# EAGLE design BIOMatrix (EAGLE 9.6.2)
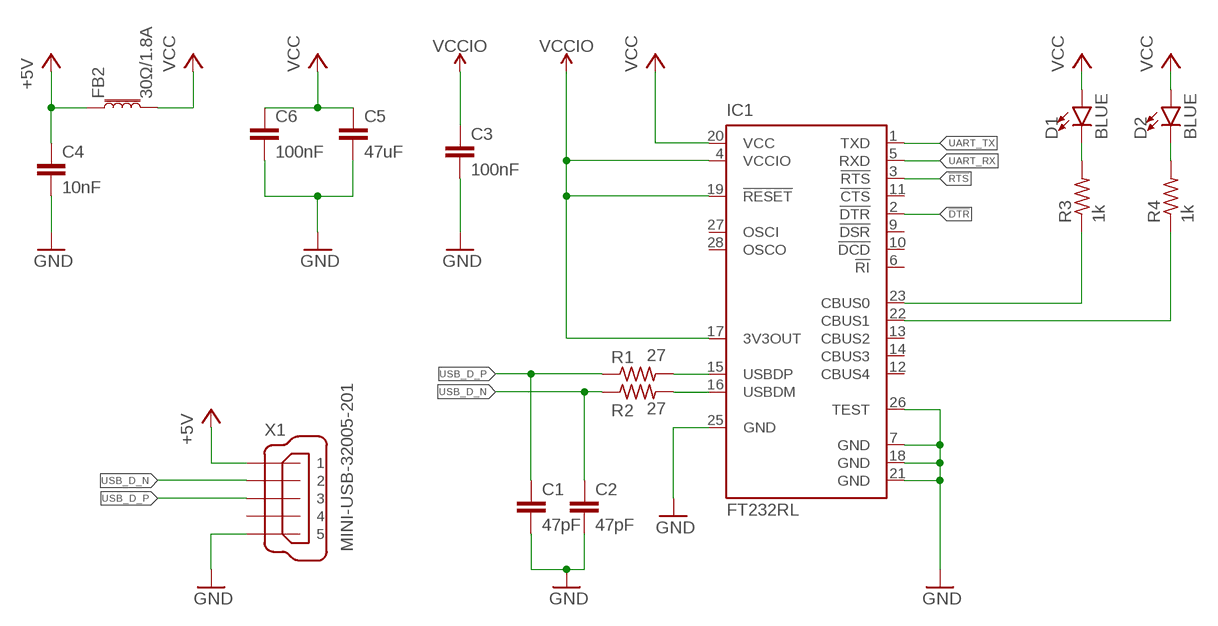
[diagram p0: schematic, sheet 1]

## Parts
C1  47pF  C-EUC0603  [C0603]
C2  47pF  C-EUC0603  [C0603]
C3  100nF  C-EUC0603  [C0603]
C4  10nF  C-EUC0603  [C0603]
C5  47uF  C-EUC0603  [C0603]
C6  100nF  C-EUC0603  [C0603]
D1  BLUE  LED-BLUE0603  [LED-0603]
D2  BLUE  LED-BLUE0603  [LED-0603]
FB2  30Ω/1.8A  FERRITE_BEAD-0603  [0603]
IC1  FT232RL  [SSOP28]
R1  27  R-US_R0603  [R0603]
R2  27  R-US_R0603  [R0603]
R3  1k  R-US_R0603  [R0603]
R4  1k  R-US_R0603  [R0603]
X1  MINI-USB-32005-201  [32005-201]

## Nets
!DTR: IC1.2(!DTR)
!RTS: IC1.3(!RTS)
+5V: C4.1 FB2.1 X1.1
GND: C1.2 C2.2 C3.2 C4.2 C5.2 C6.2 IC1.7(GND) IC1.18(GND) IC1.21(GND) IC1.25(GND) IC1.26(TEST) X1.5
N$1: IC1.15(USBDP) R1.2
N$2: D1.C R3.2
N$4: IC1.16(USBDM) R2.2
N$5: D2.C R4.2
N$6: IC1.23(CBUS0) R3.1
N$7: IC1.22(CBUS1) R4.1
UART_RX: IC1.5(RXD)
UART_TX: IC1.1(TXD)
USB_D_N [Dif_pair]: C2.1 R2.1 X1.2
USB_D_P [Dif_pair]: C1.1 R1.1 X1.3
VCC: C5.1 C6.1 D1.A D2.A FB2.2 IC1.20(VCC)
VCCIO: C3.1 IC1.4(VCCIO) IC1.17(3V3OUT) IC1.19(!RESET)
Unconnected: IC1.6(!RI) IC1.9(!DSR) IC1.10(!DCD) IC1.11(!CTS) IC1.12(CBUS4) IC1.13(CBUS2) IC1.14(CBUS3) IC1.27(OSCI) IC1.28(OSCO) X1.4

## Library data of the parts
C1-C6 = rcl:C-EU: CAPACITOR, European symbol; SPICEPREFIX: C
D1 D2 = SparkFun-LED:LED-BLUE: Blue SMD LED Used in manufacturing of various products at SparkFun Packages: 0603 - SMD 0603 package [Product Link] <http://www.digikey.com/product-detail/en/SMLE12BC7TT86/511-1589-2-ND/1641808> 1206 - SMD1206 package [Product Link] <http://www.digikey.com/product-detail/en/lite-on-inc/LTST-C150TBKT/160-1643-1-ND/573584> SparkFun Products: ESP8266 Thing-Dev Board <https://www.sparkfun.com/products/13711> RedBoard <https://www.sparkfun.com/products/12757>; PROD_ID: DIO-08575
FB2 = SparkFun-Coils:FERRITE_BEAD: Ferrite Bead (blocks, cores, rings, chokes, etc.) Inductor with layers of ferrite used to suppress high frequencies. Often used to isolate high frequency noise. SparkFun Products: IOIO-OTG - V2.2 <https://www.sparkfun.com/products/13613> SparkFun SAMD21 Mini Breakout <https://www.sparkfun.com/products/13664> SparkFun 6 Degrees of Freedom Breakout - LSM6DS3 <https://www.sparkfun.com/products/13339> SparkFun SAMD21 Dev Breakout <https://www.sparkfun.com/products/13672>; PROD_ID: NDUC-13805
IC1 = ftdichip:FT232R: Source: http://www.ftdichip.com/Documents/DataSheets/DS_FT232R_v104.pdf; MPN: FT232RL; OC_FARNELL: 1146032; OC_NEWARK: 91K9918
R1-R4 = rcl:R-US_: RESISTOR, American symbol; SPICEPREFIX: R
X1 = con-cypressindustries:MINI-USB-: MINI USB-B Conector Source: www.cypressindustries.com; OC_FARNELL: unknown; OC_NEWARK: unknown

## Net classes
1 Dif_pair: width 0.152 mm

## Board
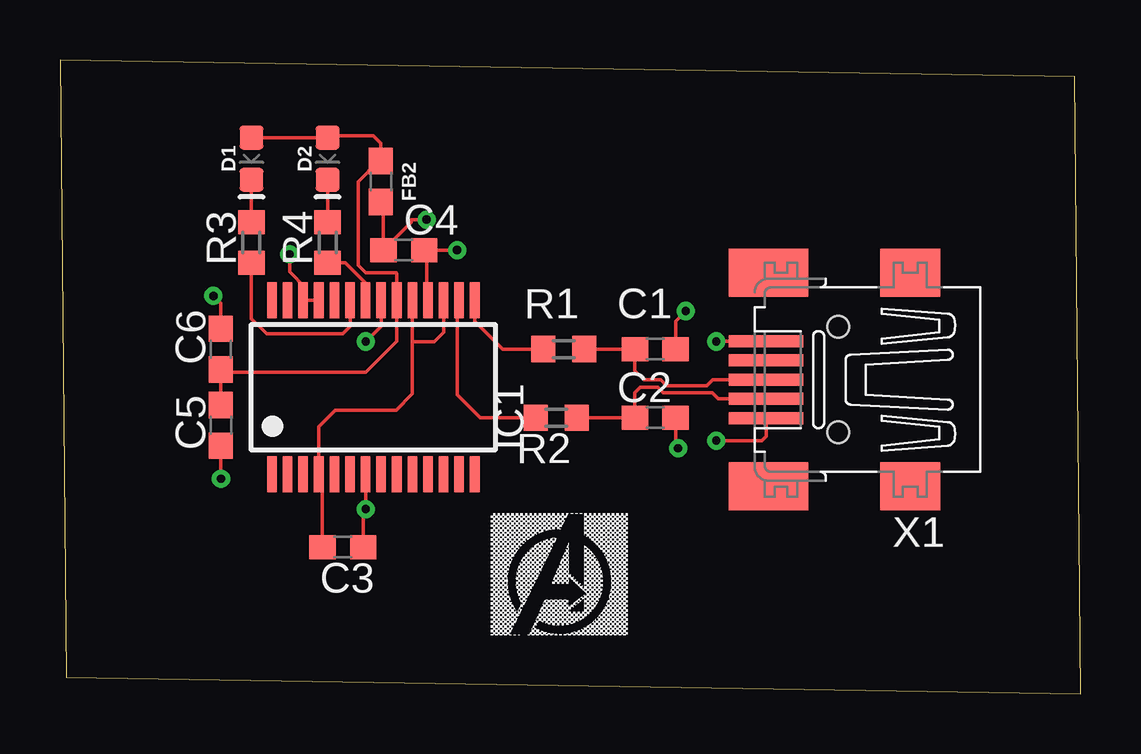
[diagram p1: board, top side]
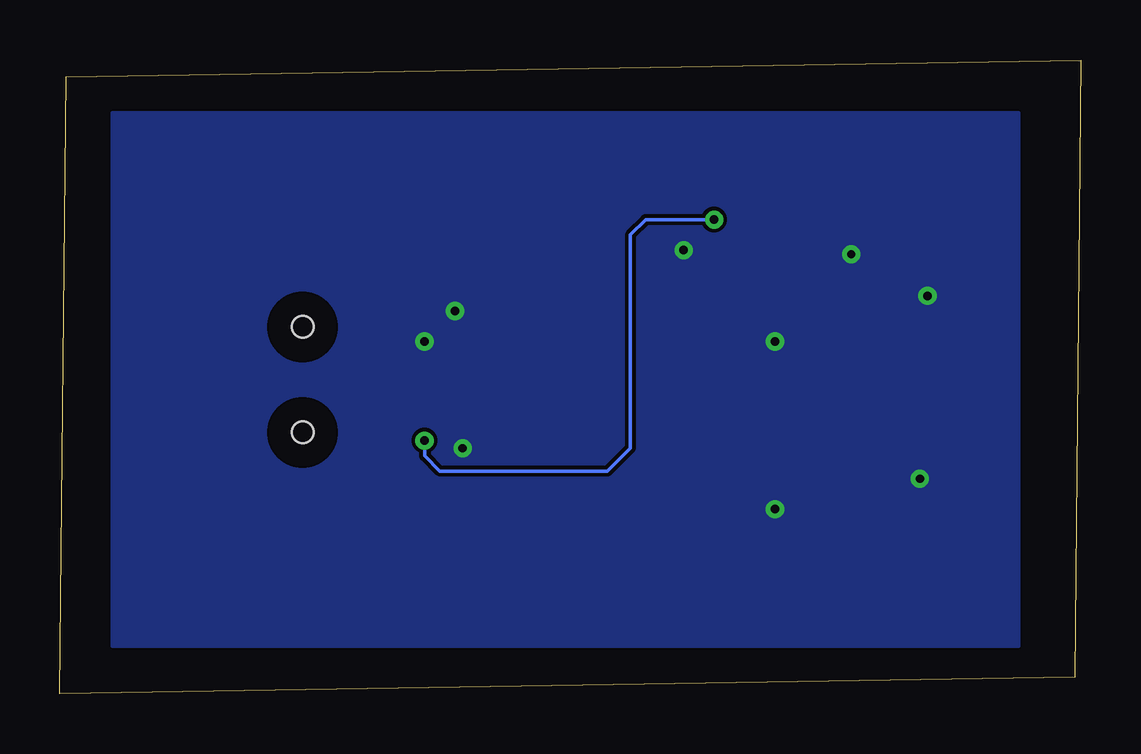
[diagram p2: board, bottom side, seen from below]

Size 42.53 x 26.41 mm. Coordinates in mm from the lower left corner, seen from the top.
Outline: 0.25,0.69 42.53,0 42.28,25.71 0,26.41 0.25,0.69
Copper layers (1*16): Top 0.035mm / dielectric 1.5mm / Bottom 0.035mm
Design rules "default": minimum track width 6mil, minimum drill 0.35mm, track to track 6mil, track to pad 6mil, pad to pad 6mil, via to via 6mil, smd to smd 6mil, copper to edge 40mil, drill to drill 6mil, minimum pad ring 10mil, minimum via ring 8mil, stop-mask expansion 4mil, vias tented up to drill 0mil, thermal gap 10mil

### Footprints (pad centres in the part's own frame; a part is rotated, then mirrored left to right if it is on the bottom)
C0603 = smd 1.1 x 1: 1 -0.85,0; 2 0.85,0
LED-0603 = smd 1 x 1: A -0.877,0; C 0.877,0
0603 = smd 1.1 x 1: 1 -0.85,0; 2 0.85,0
SSOP28 = smd 0.4 x 1.5: 1 -4.225,-3.625; 2 -3.575,-3.625; 3 -2.925,-3.625; 4 -2.275,-3.625; 5 -1.625,-3.625; 6 -0.975,-3.625; 7 -0.325,-3.625; 8 0.325,-3.625; 9 0.975,-3.625; 10 1.625,-3.625; 11 2.275,-3.625; 12 2.925,-3.625; 13 3.575,-3.625; 14 4.225,-3.625; 15 4.225,3.625; 16 3.575,3.625; 17 2.925,3.625; 18 2.275,3.625; 19 1.625,3.625; 20 0.975,3.625; 21 0.325,3.625; 22 -0.325,3.625; 23 -0.975,3.625; 24 -1.625,3.625; 25 -2.275,3.625; 26 -2.925,3.625; 27 -3.575,3.625; 28 -4.225,3.625
R0603 = smd 1 x 1.1: 1 -0.85,0; 2 0.85,0
32005-201 = smd 3.1 x 0.5: 1 3,1.6; 2 3,0.8; 3 3,0; 4 3,-0.8; 5 3,-1.6 | smd 2.5 x 2: M1 -3,-4.45; M2 -3,4.45 | smd 3.3 x 2: M3 2.9,4.45; M4 2.9,-4.45 | hole 0.9: 0,2.2; 0,-2.2

### Placement (x,y rotation side)
C1  24.8,14.36 0 top
C2  24.8,11.5 0 top
C3  11.79,6.1 0 top
C4  14.33,18.48 0 top
C5  6.71,11.18 270 top
C6  6.71,14.36 90 top
D1  7.98,22.29 270 top
D2  11.15,22.29 270 top
FB2  13.37,21.34 90 top
IC1  13.06,12.77 0 top
R1  20.99,14.36 180 top
R2  20.68,11.5 180 top
R3  7.98,18.8 90 top
R4  11.15,18.8 90 top
X1  32.42,13.09 180 top

### Tracks (layer width: path | path; a pad name or v marks a point on that pad's centre or on a via)
+5V  (via drill 0.35)
  Top 0.152: FB2.1 13.48,20.39 C4.1 14.64,19.65 14.64,19.76 v15.28,19.76 | v27.34,10.55 29.25,10.55 29.42,10.72 X1.1
  Bottom 0.152: v15.28,19.76 18.14,19.76 18.77,19.12 18.77,10.23 19.72,9.28 26.71,9.28 27.34,9.91 v27.34,10.55
GND  (via drill 0.35)
  Top 0.152: X1.5 27.36,14.69 v27.34,14.68 | C1.2 25.65,15.52 v26.07,15.94 | C4.2 15.28,18.48 | 15.28,18.48 v16.55,18.48 | C6.2 6.71,16.26 v6.39,16.58 | C5.2 v6.71,8.96 | IC1.7 v12.74,7.69 12.64,7.59 C3.2 | C2.2 25.65,10.33 v25.76,10.23 | v9.56,18.31 9.56,17.59 10.23,16.92 10.23,16.49 IC1.26 IC1.25 | IC1.18 15.28,16.45 15.28,18.48 | IC1.21 13.38,15.32 v12.74,14.68
  pour Bottom: 2.58,24.2 2.58,1.97 40.36,1.97 40.36,24.2
N$1
  Top 0.152: R1.2 18.45,14.36 17.28,15.53 IC1.15
N$2
  Top 0.152: D1.C R3.2
N$4
  Top 0.152: R2.2 17.5,11.5 16.55,12.45 16.55,16.31 IC1.16
N$5
  Top 0.152: D2.C R4.2
N$6
  Top 0.152: R3.1 7.98,15.63 8.61,14.99 11.79,14.99 12.1,15.31 12.1,16.37 IC1.23
N$7
  Top 0.152: R4.1 11.89,17.95 12.74,17.1 IC1.22
USB_D_N
  Top 0.152: X1.2 27.43,12.29 27.18,12.54 25.14,12.54 24.9,12.78 24.19,12.78 23.95,12.54 C2.1 R2.1
USB_D_P
  Top 0.152: X1.3 27.2,13.09 26.95,12.84 25.26,12.84 25.02,13.08 24.33,13.08 23.95,13.46 C1.1 R1.1
VCC
  Top 0.152: C6.1 6.81,13.41 | 6.81,13.41 12.74,13.41 14.03,14.7 IC1.20 14.03,17.51 14.01,17.53 12.74,17.53 12.42,17.85 12.42,21.34 13.27,22.19 FB2.2 13.37,22.93 13.06,23.25 11.23,23.25 D2.A D1.A | C5.1 6.71,13.3 6.81,13.41
VCCIO
  Top 0.152: C3.1 10.94,8.99 IC1.4 10.78,11.13 11.47,11.82 14.01,11.82 14.68,12.49 14.68,14.68 | 14.68,14.68 IC1.19 | IC1.17 15.98,15.06 15.6,14.68 14.68,14.68

### Text on the board
bPlace: C:/Users/jjrr_/Downloads/avengers.bmp